# EAGLE design TriVCO_board_layout_FINAL_edited_10-22 (EAGLE 9.6.2)
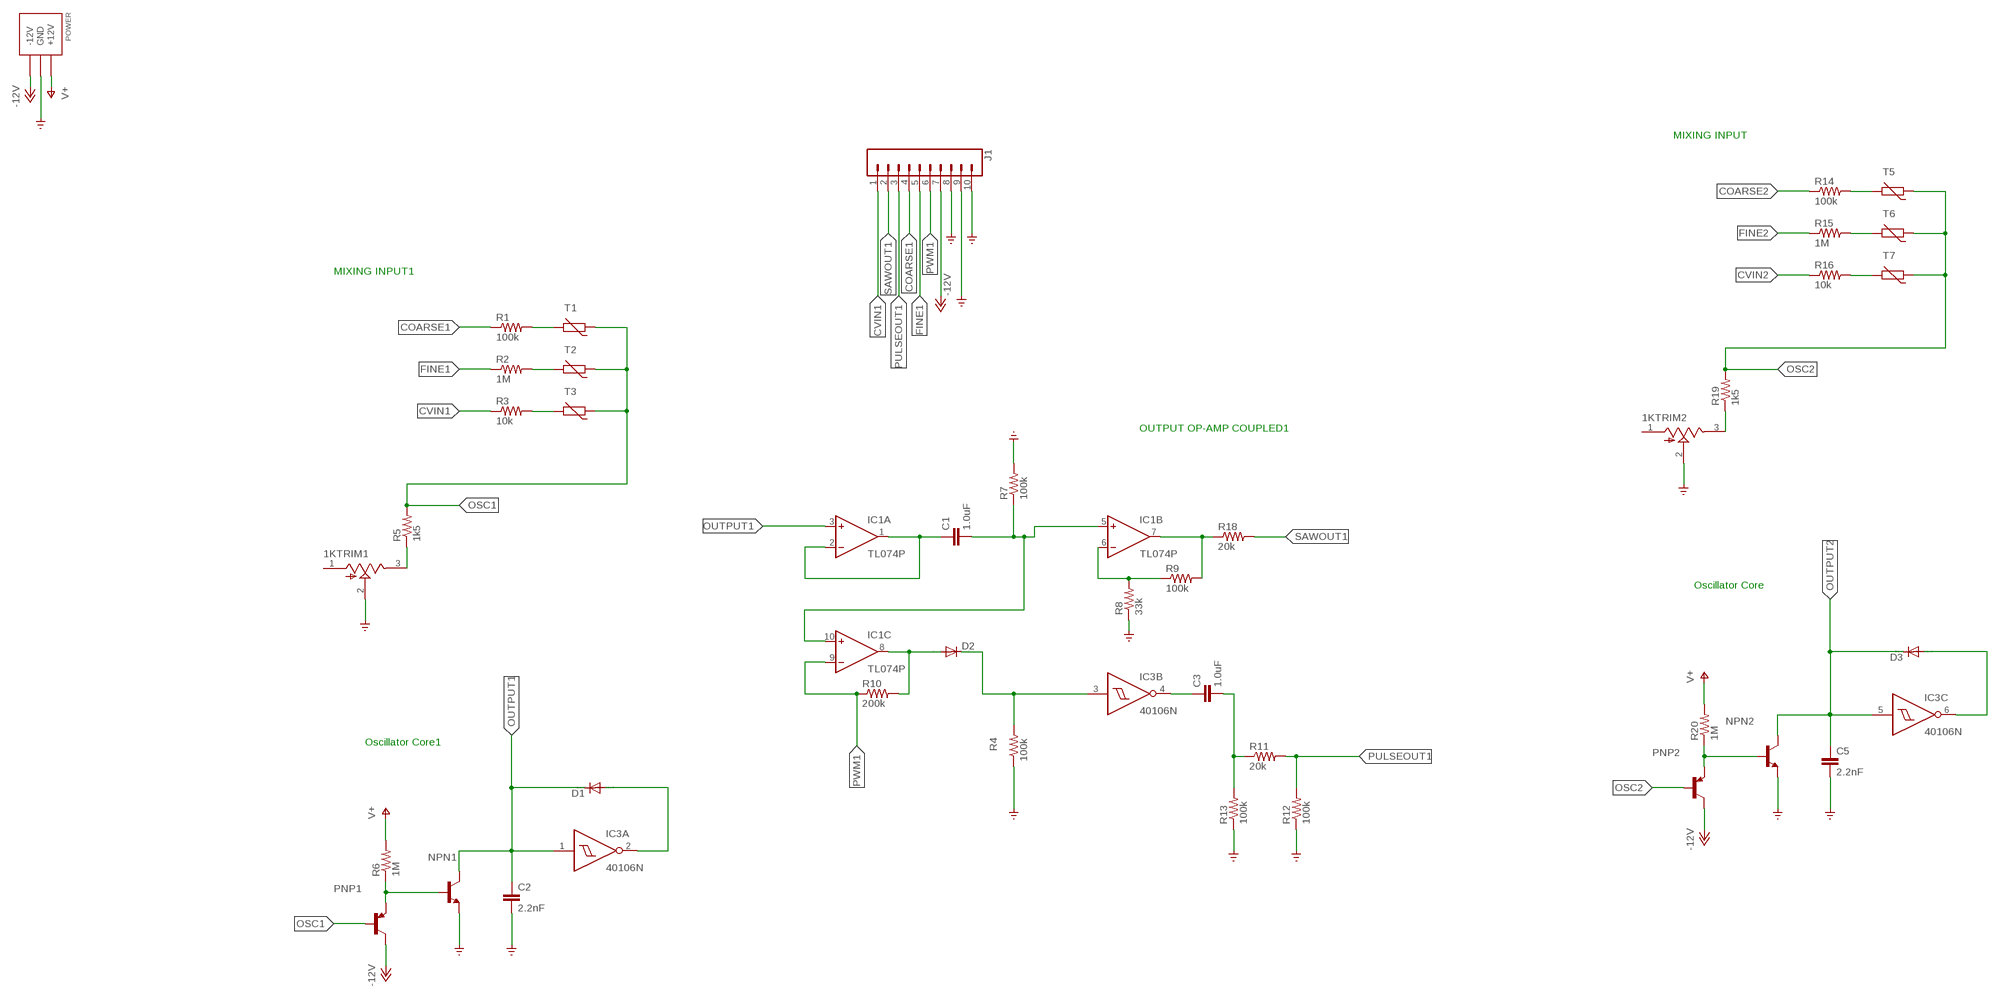
[diagram p0: schematic, sheet 1, part 1 of 2]
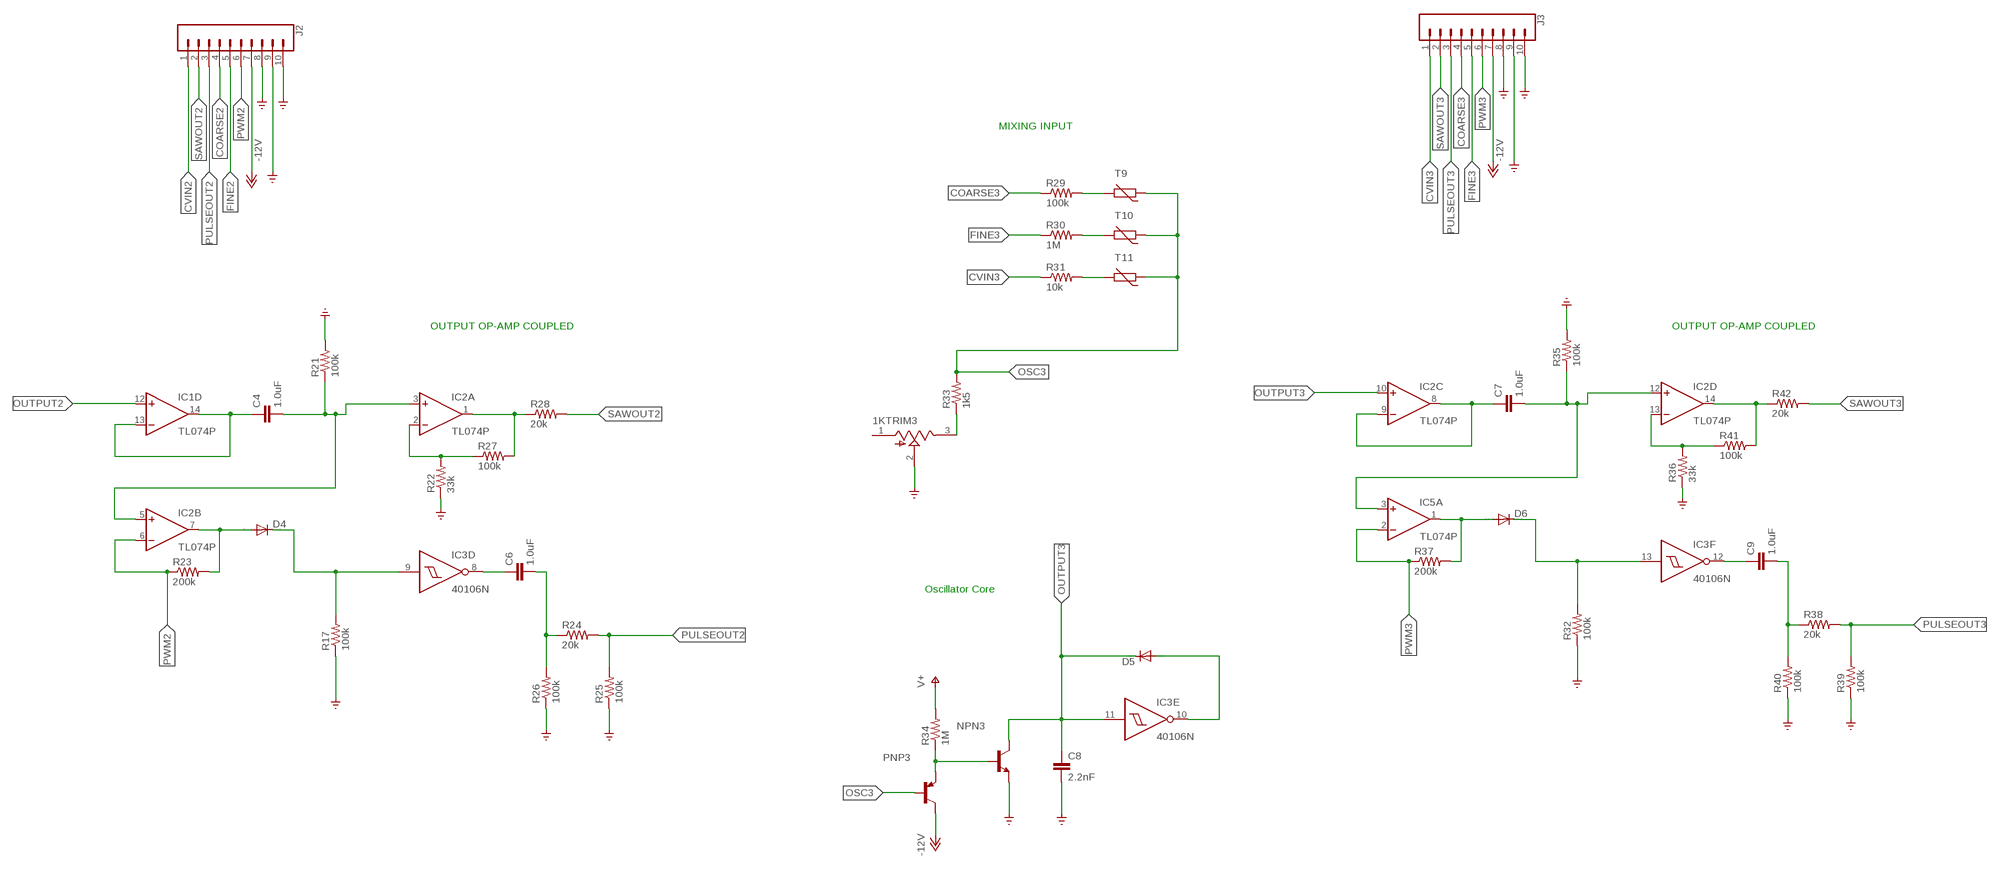
[diagram p1: schematic, sheet 1, part 2 of 2]

## Parts
1KTRIM1  3362P-1-102LF  [TRIM_3362P-1-102LF]
1KTRIM2  3362P-1-102LF  [TRIM_3362P-1-102LF]
1KTRIM3  3362P-1-102LF  [TRIM_3362P-1-102LF]
C1  1.0uF  1.0UF-0603-16V-10%  [0603]
C2  2.2nF  1.0UF-0603-16V-10%  [0603]
C3  1.0uF  1.0UF-0402-16V-10%  [0402]
C4  1.0uF  1.0UF-0603-16V-10%  [0603]
C5  2.2nF  1.0UF-0603-16V-10%  [0603]
C6  1.0uF  1.0UF-0402-16V-10%  [0402]
C7  1.0uF  1.0UF-0603-16V-10%  [0603]
C8  2.2nF  1.0UF-0603-16V-10%  [0603]
C9  1.0uF  1.0UF-0402-16V-10%  [0402]
D1  1N4148DO35-7  [DO35-7]
D2  1N4148DO35-7  [DO35-7]
D3  1N4148DO35-7  [DO35-7]
D4  1N4148DO35-7  [DO35-7]
D5  1N4148DO35-7  [DO35-7]
D6  1N4148DO35-7  [DO35-7]
IC1  TL074P  [DIL14]
IC2  TL074P  [DIL14]
IC3  40106N  [DIL14]
IC5  TL074P  [DIL14]
J1  CONN_10"  [1X10]
J2  CONN_10"  [1X10]
J3  CONN_10"  [1X10]
NPN1  BC485-NPN-TO92-CBE  [TO92-CBE]
NPN2  BC485-NPN-TO92-CBE  [TO92-CBE]
NPN3  BC485-NPN-TO92-CBE  [TO92-CBE]
PNP1  BC450-PNP-TO92-EBC  [TO92-EBC]
PNP2  BC450-PNP-TO92-EBC  [TO92-EBC]
PNP3  BC450-PNP-TO92-EBC  [TO92-EBC]
POWER  POWER_SIMPLE10  [POWER_10]
R1  100k  R-US_0207/10  [0207/10]
R2  1M  R-US_0207/10  [0207/10]
R3  10k  R-US_0207/10  [0207/10]
R4  100k  R-US_0207/10  [0207/10]
R5  1k5  R-US_0207/10  [0207/10]
R6  1M  R-US_0207/10  [0207/10]
R7  100k  R-US_0207/10  [0207/10]
R8  33k  R-US_0207/10  [0207/10]
R9  100k  R-US_0207/10  [0207/10]
R10  200k  R-US_0207/10  [0207/10]
R11  20k  R-US_0207/10  [0207/10]
R12  100k  R-US_0207/10  [0207/10]
R13  100k  R-US_0207/10  [0207/10]
R14  100k  R-US_0207/10  [0207/10]
R15  1M  R-US_0207/10  [0207/10]
R16  10k  R-US_0207/10  [0207/10]
R17  100k  R-US_0207/10  [0207/10]
R18  20k  R-US_0207/10  [0207/10]
R19  1k5  R-US_0207/10  [0207/10]
R20  1M  R-US_0207/10  [0207/10]
R21  100k  R-US_0207/10  [0207/10]
R22  33k  R-US_0207/10  [0207/10]
R23  200k  R-US_0207/10  [0207/10]
R24  20k  R-US_0207/10  [0207/10]
R25  100k  R-US_0207/10  [0207/10]
R26  100k  R-US_0207/10  [0207/10]
R27  100k  R-US_0207/10  [0207/10]
R28  20k  R-US_0207/10  [0207/10]
R29  100k  R-US_0207/10  [0207/10]
R30  1M  R-US_0207/10  [0207/10]
R31  10k  R-US_0207/10  [0207/10]
R32  100k  R-US_0207/10  [0207/10]
R33  1k5  R-US_0207/10  [0207/10]
R34  1M  R-US_0207/10  [0207/10]
R35  100k  R-US_0207/10  [0207/10]
R36  33k  R-US_0207/10  [0207/10]
R37  200k  R-US_0207/10  [0207/10]
R38  20k  R-US_0207/10  [0207/10]
R39  100k  R-US_0207/10  [0207/10]
R40  100k  R-US_0207/10  [0207/10]
R41  100k  R-US_0207/10  [0207/10]
R42  20k  R-US_0207/10  [0207/10]
T1  THERMISTOR-5  [R-5]
T2  THERMISTOR-5  [R-5]
T3  THERMISTOR-5  [R-5]
T5  THERMISTOR-5  [R-5]
T6  THERMISTOR-5  [R-5]
T7  THERMISTOR-5  [R-5]
T9  THERMISTOR-5  [R-5]
T10  THERMISTOR-5  [R-5]
T11  THERMISTOR-5  [R-5]

## Nets
COARSE1: J1.4 R1.1
COARSE2: J2.4 R14.1
COARSE3: J3.4 R29.1
CVIN1: J1.1 R3.1
CVIN2: J2.1 R16.1
CVIN3: J3.1 R31.1
FINE1: J1.5 R2.1
FINE2: J2.5 R15.1
FINE3: J3.5 R30.1
GND: 1KTRIM1.2(WIPER) 1KTRIM2.2(WIPER) 1KTRIM3.2(WIPER) C2.2 C5.2 C8.2 J1.8 J1.9 J1.10 J2.8 J2.9 J2.10 J3.8 J3.9 J3.10 NPN1.E NPN2.E NPN3.E POWER.3(GND) POWER.4(GND) POWER.5(GND) POWER.6(GND) POWER.7(GND) POWER.8(GND) R4.1 R7.2 R8.1 R12.1 R13.1 R17.1 R21.2 R22.1 R25.1 R26.1 R32.1 R35.2 R36.1 R39.1 R40.1 ; supply symbol labelled SUPPLY0_GND_
N$1: R14.2 T5.2
N$2: R1.2 T1.2
N$3: R15.2 T6.2
N$4: R2.2 T2.2
N$6: R16.2 T7.2
N$8: 1KTRIM2.3(CW) R19.1
N$9: R3.2 T3.2
N$10: 1KTRIM1.3(CW) R5.1
N$11: NPN1.B PNP1.E R6.1
N$12: NPN2.B PNP2.E R20.1
N$13: D1.A IC3.2(A:O)
N$14: D3.A IC3.6(C:O)
N$15: C1.1 IC1.1(A:OUT) IC1.2(A:-IN)
N$16: C1.2 IC1.5(B:+IN) IC1.10(C:+IN) R7.1
N$17: IC1.6(B:-IN) R8.2 R9.1
N$18: IC1.7(B:OUT) R9.2 R18.1
N$19: C4.1 IC1.13(D:-IN) IC1.14(D:OUT)
N$20: D2.A IC1.8(C:OUT) R10.2
N$21: C4.2 IC2.3(A:+IN) IC2.5(B:+IN) R21.1
N$22: D2.C IC3.3(B:I) R4.2
N$23: C3.1 IC3.4(B:O)
N$24: C3.2 R11.1 R13.2
N$25: IC2.2(A:-IN) R22.2 R27.1
N$26: IC2.1(A:OUT) R27.2 R28.1
N$27: D4.A IC2.7(B:OUT) R23.2
N$28: D4.C IC3.9(D:I) R17.2
N$29: C6.1 IC3.8(D:O)
N$30: C6.2 R24.1 R26.2
N$31: R29.2 T9.2
N$32: R30.2 T10.2
N$34: R31.2 T11.2
N$35: 1KTRIM3.3(CW) R33.1
N$36: NPN3.B PNP3.E R34.1
N$37: D5.A IC3.10(E:O)
N$38: C7.1 IC2.8(C:OUT) IC2.9(C:-IN)
N$39: C7.2 IC2.12(D:+IN) IC5.3(A:+IN) R35.1
N$40: IC2.13(D:-IN) R36.2 R41.1
N$41: IC2.14(D:OUT) R41.2 R42.1
N$42: D6.A IC5.1(A:OUT) R37.2
N$43: D6.C IC3.13(F:I) R32.2
N$44: C9.1 IC3.12(F:O)
N$45: C9.2 R38.1 R40.2
OSC1: PNP1.B R5.2 T1.1 T2.1 T3.1
OSC2: PNP2.B R19.2 T5.1 T6.1 T7.1
OSC3: PNP3.B R33.2 T9.1 T10.1 T11.1
OUTPUT1: C2.1 D1.C IC1.3(A:+IN) IC3.1(A:I) NPN1.C
OUTPUT2: C5.1 D3.C IC1.12(D:+IN) IC3.5(C:I) NPN2.C
OUTPUT3: C8.1 D5.C IC2.10(C:+IN) IC3.11(E:I) NPN3.C
PULSEOUT1: J1.3 R11.2 R12.2
PULSEOUT2: J2.3 R24.2 R25.2
PULSEOUT3: J3.3 R38.2 R39.2
PWM1: IC1.9(C:-IN) J1.6 R10.1
PWM2: IC2.6(B:-IN) J2.6 R23.1
PWM3: IC5.2(A:-IN) J3.6 R37.1
SAWOUT1: J1.2 R18.2
SAWOUT2: J2.2 R28.2
SAWOUT3: J3.2 R42.2
V+: POWER.9(+12V) POWER.10(+12V) R6.2 R20.2 R34.2
V-: J1.7 J2.7 J3.7 PNP1.C PNP2.C PNP3.C POWER.1(-12V) POWER.2(-12V) ; supply symbol labelled -12V
Unconnected: 1KTRIM1.1(CCW) 1KTRIM2.1(CCW) 1KTRIM3.1(CCW) IC5.5(B:+IN) IC5.6(B:-IN) IC5.7(B:OUT) IC5.8(C:OUT) IC5.9(C:-IN) IC5.10(C:+IN) IC5.12(D:+IN) IC5.13(D:-IN) IC5.14(D:OUT)

## Notes on the sheet
- MIXING INPUT
- MIXING INPUT
- MIXING INPUT1
- OUTPUT OP-AMP COUPLED | OUTPUT OP-AMP COUPLED
- OUTPUT OP-AMP COUPLED1
- Oscillator Core
- Oscillator Core
- Oscillator Core1

## Power pins joined to a net without a drawn wire
GND: IC3.7(P:VSS)
V+: IC1.4(P:V+) IC2.4(P:V+) IC3.14(P:VDD) IC5.4(P:V+)
V-: IC1.11(P:V-) IC2.11(P:V-) IC5.11(P:V-)

## Library data of the parts
1KTRIM1-1KTRIM3 = 3362P-1-102LF:3362P-1-102LF: Res Cermet Trimmer 50K Ohm 10% 1/2W 1(Elec)/1(Mech)Turn 2.77mm (6.6 X 6.99 X 4.7mm) Pin Thru-Hole Tube Check prices <https://pricing.snapeda.com/parts/3362P-1-102LF/Bourns/view-part?ref=eda>; AVAILABILITY: Good; DESCRIPTION: 1 kOhms 0.5W, 1/2W PC Pins Through Hole Trimmer Potentiometer Cermet 1 Turn Top Adjustment; MF: Bourns; MP: 3362P-1-102LF; PACKAGE: 3362P-1 Bourns Inc.; PRICE: None; PURCHASE-URL: https://pricing.snapeda.com/search/part/3362P-1-102LF/?ref=eda
C1 C4 C7 = SparkFun-Capacitors:1.0UF: 1µF ceramic capacitors A capacitor is a passive two-terminal electrical component used to store electrical energy temporarily in an electric field.; PROD_ID: CAP-00868
C2 C5 C8 = SparkFun-Capacitors:1.0UF: 1µF ceramic capacitors A capacitor is a passive two-terminal electrical component used to store electrical energy temporarily in an electric field.; PROD_ID: CAP-00868; VALUE: 1.0uF
C3 C6 C9 = SparkFun-Capacitors:1.0UF: 1µF ceramic capacitors A capacitor is a passive two-terminal electrical component used to store electrical energy temporarily in an electric field.; PROD_ID: CAP-12417
D1-D6 = diode:1N4148: DIODE high speed (Philips)
IC1 IC2 IC5 = linear2:TL074: OP AMP
IC3 = 40xx:40106: Hex SCHMITT TRIGGER
J1-J3 = SparkFun-Connectors:CONN_10: Multi connection point. Often used as Generic Header-pin footprint for 0.1 inch spaced/style header connections On any of the 0.1 inch spaced packages, you can populate with these: Break Away Headers - Straight <https://www.sparkfun.com/products/116> (PRT-00116) Break Away Male Headers - Right Angle <https://www.sparkfun.com/products/553> (PRT-00553) Female Headers <https://www.sparkfun.com/products/115> (PRT-00115) Break Away Headers - Machine Pin <https://www.sparkfun.com/products/117> (PRT-00117) Break Away Female Headers - Swiss Machine Pin <https://www.sparkfun.com/products/743> (PRT-00743) Arduino Stackable Header - 10 Pin <https://www.sparkfun.com/products/11376> (PRT-11376) For SCREWTERMINALS and SPRING TERMINALS visit here: Screw Terimnals on SparkFun.com <https://www.sparkfun.com/search/results?term=Screw+Terminals> (5mm/3.5mm/2.54mm spacing) This device is also useful as a general connection point to wire up your design to another part of your project. Our various solder wires solder well into these plated through hole pads. Hook-Up Wire - Assortment (Stranded, 22 AWG) <https://www.sparkfun.com/products/11375> (PRT-11375) Hook-Up Wire - Assortment (Solid Core, 22 AWG) <https://www.sparkfun.com/products/11367> (PRT-11367) View the entire wire category on our website here <https://www.sparkfun.com/categories/141> Special notes: Molex polarized connector foot print use with SKU : PRT-08231 with associated crimp pins and housings. 1MM SMD Version SKU: PRT-10208 NOTES ON THE VARIANTS LOCK and LOCK_LONGPADS... This footprint was designed to help hold the alignment of a through-hole component (i.e. 6-pin header) while soldering it into place. You may notice that each hole has been shifted either up or down by 0.005 of an inch from it's more standard position (which is a perfectly straight line). This slight alteration caused the pins (the squares in the middle) to touch the edges of the holes. Because they are alternating, it causes a "brace" to hold the component in place. 0.005 has proven to be the perfect amount of "off-center" position when using our standard breakaway headers. Although looks a little odd when you look at the bare footprint, once you have a header in there, the alteration is very hard to notice. Also,if you push a header all the way into place, it is covered up entirely on the bottom side.; PROD_ID: CONN-11563
NPN1-NPN3 = transistor:*-NPN-: NPN Transistror BF959 corrected 2008.03.06
PNP1-PNP3 = transistor:*-PNP-: PNP Transistror
POWER = EurorackModularParts:POWER_SIMPLE
R1-R42 = resistor:R-US_: RESISTOR, American symbol
T1-T3 T5-T7 T9-T11 = varistor:THERMISTOR: THERMISTOR

## Board
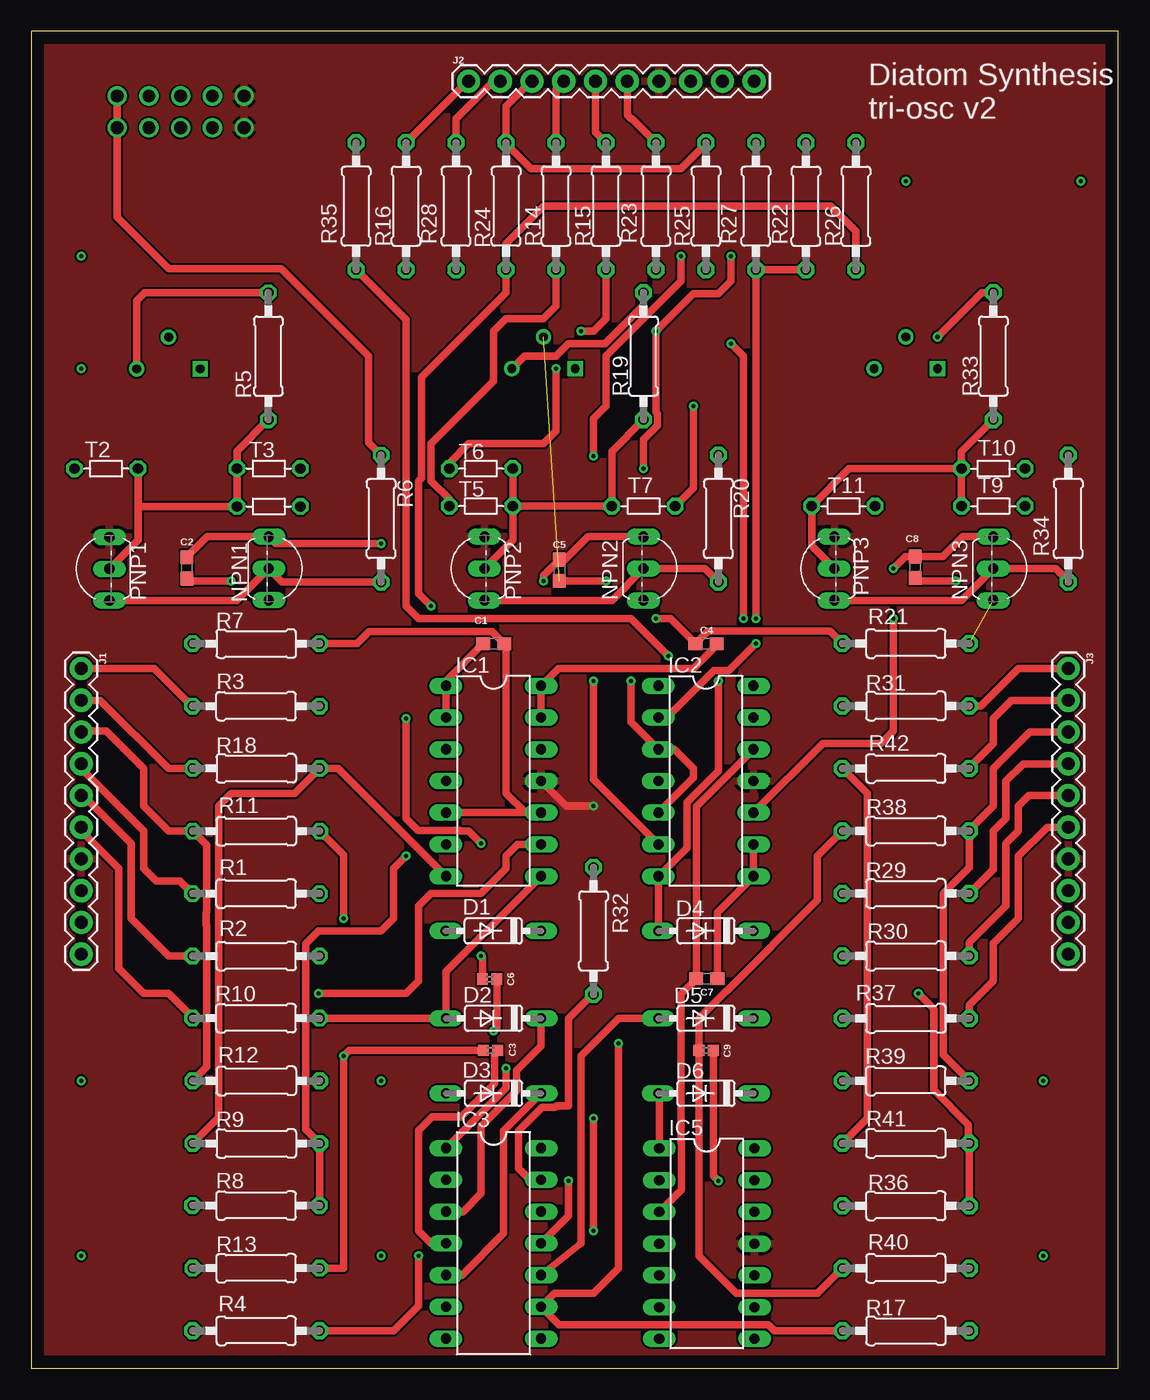
[diagram p2: board, top side]
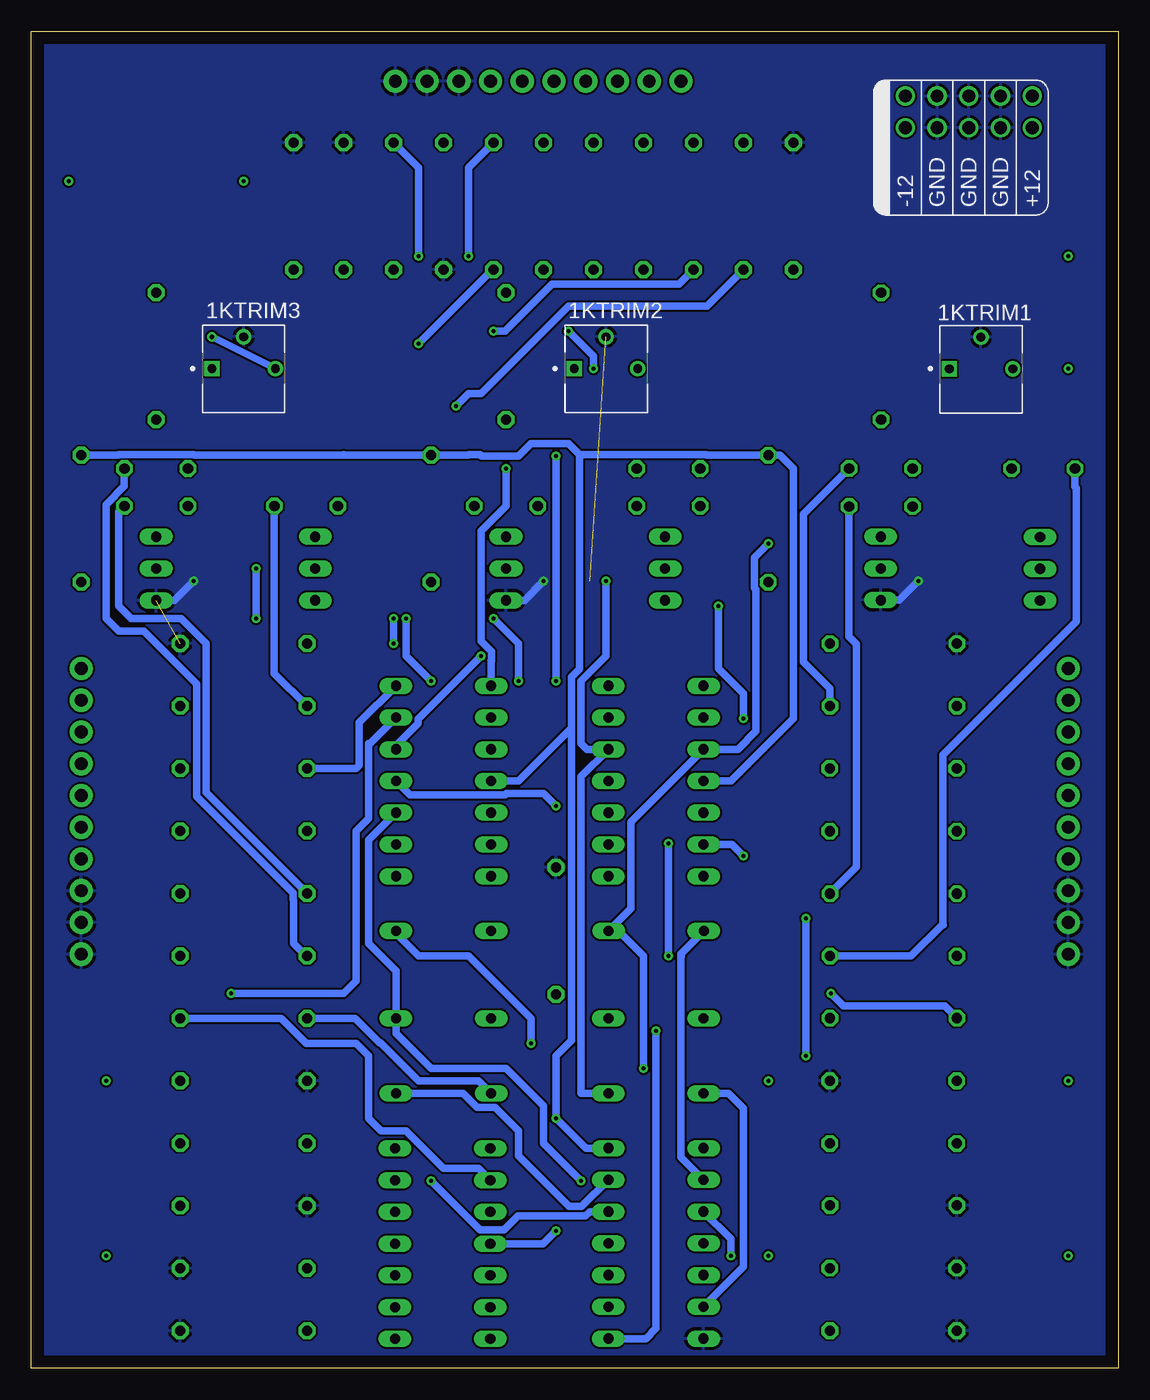
[diagram p3: board, bottom side, seen from below]

Size 87 x 107 mm. Coordinates in mm from the lower left corner, seen from the top.
Outline: 0,0 87,0 87,107 0,107 0,0
Copper layers (1*16): Top 0.035mm / dielectric 1.5mm / Bottom 0.035mm
Design rules "default": minimum track width 6mil, minimum drill 0.35mm, track to track 6mil, track to pad 6mil, pad to pad 6mil, via to via 6mil, smd to smd 6mil, copper to edge 40mil, drill to drill 6mil, minimum pad ring 10mil, minimum via ring 8mil, stop-mask expansion 4mil, vias tented up to drill 0mil, thermal gap 10mil

### Footprints (pad centres in the part's own frame; a part is rotated, then mirrored left to right if it is on the bottom)
TRIM_3362P-1-102LF = drill 0.714 square: 1 -2.54,0 | drill 0.714: 2 0,2.54; 3 2.54,0
0603 = smd 1.1 x 1: 1 -0.85,0; 2 0.85,0
0402 = smd 0.85 x 0.9: 1 -0.58,0; 2 0.58,0
DO35-7 = drill 0.813 long: A 3.81,0; C -3.81,0
DIL14 = drill 0.813 long: 1 -7.62,-3.81; 2 -5.08,-3.81; 3 -2.54,-3.81; 4 0,-3.81; 5 2.54,-3.81; 6 5.08,-3.81; 7 7.62,-3.81; 8 7.62,3.81; 9 5.08,3.81; 10 2.54,3.81; 11 0,3.81; 12 -2.54,3.81; 13 -5.08,3.81; 14 -7.62,3.81
1X10 = drill 1.016 pad 1.88: 1 0,0; 2 2.54,0; 3 5.08,0; 4 7.62,0; 5 10.16,0; 6 12.7,0; 7 15.24,0; 8 17.78,0; 9 20.32,0; 10 22.86,0
TO92-CBE = drill 0.813 long: B 0,0; C -2.54,0; E 2.54,0
TO92-EBC = drill 0.813 long: B 0,-1.27; C 2.54,-1.27; E -2.54,-1.27
POWER_10 = drill 1.016: 1 -5.08,-1.27; 2 -5.08,1.27; 3 -2.54,-1.27; 4 -2.54,1.27; 5 0,-1.27; 6 0,1.27; 7 2.54,-1.27; 8 2.54,1.27; 9 5.08,-1.27; 10 5.08,1.27
0207/10 = drill 0.813 octagon: 1 -5.08,0; 2 5.08,0
R-5 = drill 0.813 octagon: 1 -2.54,0; 2 2.54,0

### Placement (x,y rotation side)
1KTRIM1  10.99,79.98 0 bottom
1KTRIM2  41,80 0 bottom
1KTRIM3  70,80 0 bottom
C1  37.01,57.98 0 top
C2  12.45,64.05 270 top
C3  36.77,25.45 180 top
C4  54,58 180 top
C5  42.27,63.87 270 top
C6  36.69,31.14 180 top
C7  54.08,31.17 180 top
C8  70.74,64.1 270 top
C9  54.02,25.44 180 top
D1  36.98,35 180 top
D2  37,28 180 top
D3  37,22 180 top
D4  54,35 180 top
D5  54,28 180 top
D6  54,22 180 top
IC1  37,47 270 top
IC2  54,47 270 top
IC3  37,10 270 top
IC5  54.07,9.97 270 top
J1  4,56 270 top
J2  35,103 0 top
J3  83,56 270 top
NPN1  19,64 270 top
NPN2  49,64 270 top
NPN3  77,64 270 top
PNP1  4.99,63.98 90 top
PNP2  35,64 90 top
PNP3  63,64 90 top
POWER  11.96,100.55 0 bottom
R1  17.99,37.99 0 top
R2  18,32.99 0 top
R3  17.99,52.99 0 top
R4  18,3 0 top
R5  18.98,81 270 top
R6  28,68 90 top
R7  18,57.99 180 top
R8  18,13.03 0 top
R9  18.01,17.99 180 top
R10  17.99,28.02 0 top
R11  18.01,42.98 180 top
R12  18.01,23 180 top
R13  18,8.01 0 top
R14  42,93 270 top
R15  46,93 270 top
R16  30,93 270 top
R17  70,3 180 top
R18  18.01,48.01 180 top
R19  49,81 270 top
R20  55,68 90 top
R21  70,58 0 top
R22  62,93 270 top
R23  50,93 270 top
R24  38,93 90 top
R25  54,93 90 top
R26  66,93 270 top
R27  58,93 90 top
R28  34,93 90 top
R29  70,38 180 top
R30  70,33 180 top
R31  70,53 180 top
R32  45,35 270 top
R33  77,81 270 top
R34  83,68 90 top
R35  26,93 90 top
R36  70,13 0 top
R37  70,28 180 top
R38  70,43 0 top
R39  70,23 0 top
R40  70,8 180 top
R41  70,18 180 top
R42  70,48 0 top
T1  19,68.97 0 top
T2  6.01,71.99 180 top
T3  19,72.01 0 top
T5  36,69 180 top
T6  36,72 180 top
T7  49,69 0 top
T9  77,69 0 top
T10  77,72 0 top
T11  65,69 0 top

### Tracks (layer width: path | path; a pad name or v marks a point on that pad's centre or on a via)
COARSE1
  Top 0.61: J1.4 4,48 9,43 9,40 10,39 11.9,39 R1.1
COARSE2
  Top 0.61: J2.4 42,102.38 R14.1
COARSE3
  Top 0.61: R29.1 77,39.92 77,43 78,44 78,47 79.38,48.38 J3.4
CVIN1
  Top 0.61: R3.1 12.83,52.99 9.82,56 J1.1
CVIN2
  Top 0.61: J2.1 34.92,103 R16.1
CVIN3
  Top 0.61: R31.1 76,53 79,56 J3.1
FINE1
  Top 0.61: J1.5 4.16,45.84 8,42 8,36 11.01,32.99 R2.1
FINE2
  Top 0.61: R15.1 45.16,98.92 J2.5
FINE3
  Top 0.61: R30.1 75.08,34.08 78,37 78,42 79,43 79,45 79.84,45.84 J3.5
GND  (via drill 0.35)  (2 unrouted)
  Top 0.61: v16,63 12.66,63 C2.2 | C5.2 42.28,63 v46,63 | v74,63 70.99,63 C8.2
  Bottom 0.61: NPN1.E 17.54,61.46 v16,63 | NPN2.E 47.54,61.46 v46,63 | NPN3.E 75.54,61.46 v74,63
  pour Bottom: 0,107 0,0 87,0 87,107
N$1
  Top 0.61: T5.2 33.46,69.54 32,71 32,74 37,79 37,83 38,84 41,84 42,85 R14.2
N$2
  Bottom 0.61: T1.2 21.54,58.54 20.95,57.95 20.95,40.11 R1.2
N$3  (via drill 0.35)
  Top 0.61: v44,83 45,83 46,84 R15.2 | T6.2 33.46,72.46 35,74 41,74 42,75 v42,80
  Bottom 0.61: v44,83 42,81 v42,80
N$4
  Bottom 0.61: T2.2 3.47,70.56 3.36,70.46 3.36,59.75 14.05,49.06 14.05,35.54 | 14,35.49 14.05,35.54 | 14.05,35.54 16.59,32.99 R2.2
N$5  (via drill 0.35)
  other vias: 28,23
N$6  (via drill 0.35)
  Top 0.61: T7.2 53,70.46 v53,77
  Bottom 0.61: v53,77 52,78 51,78 44,85 32.92,85 R16.2
N$7  (via drill 0.35)
  other vias: 28,9
N$8
  Top 0.61: R19.1 49,85.08 45.92,82 43,82 42,81 39.46,81 1KTRIM2.3
N$9
  Bottom 0.61: R3.2 23.07,54.4 25.19,56.53 25.19,68.36 T3.2
N$10
  Top 0.61: 1KTRIM1.3 8.45,85.45 9.08,86.08 R5.1
N$11
  Top 0.61: PNP1.E 16.44,61.44 NPN1.B 20.09,62.92 R6.1
N$12
  Top 0.61: R20.1 53.92,64 NPN2.B 46.46,61.46 PNP2.E
N$13
  Bottom 0.61: 34.97,32.97 35,33 | 35,33 35,33.17 D1.A | IC3.2 35,16.89 35,33
N$14
  Bottom 0.61: D3.A 31.19,22 30,20.81 30,8.11 IC3.6
N$15
  Top 0.61: C1.1 33.19,55.01 IC1.1 IC1.2
N$16
  Top 0.61: IC1.5 IC1.10 39.54,44.46 38,46 38,57.84 C1.2 36.9,58.94 27.03,58.94 26.07,57.99 R7.1
N$17  (via drill 0.35)
  Top 0.61: R8.2 23.08,17.98 R9.1 21.95,19.13 21.95,33.95 23,35 28,35 29,36 29,40 v30,41
  Bottom 0.61: IC1.6 30.92,41.92 v30,41
N$18
  Top 0.61: R9.2 15,20.06 15,45 16.01,46.01 21.09,46.01 R18.1 24.56,48.01 IC1.7
N$19
  Top 0.61: C4.1 54.85,57.85 53,56 42.19,56 IC1.14 IC1.13
N$20
  Top 0.61: R10.2 23.09,28 D2.A 33.19,31.76 IC1.8
N$21  (via drill 0.35)
  Top 0.61: R21.1 63.92,59 54.15,59 C4.2 51.15,60 v50,60 | v48,55 48,51.73 IC2.3 51.46,49.54 53,48 53,47.27 IC2.5
  Bottom 0.61: v48,55 48,58 v50,60
N$22  (via drill 0.35)
  Top 0.61: D2.C 40.81,25.81 38.84,23.84 38.84,22.19 36,19.35 36,14 34.54,12.54 IC3.3 | R4.2 29,3 31,5 v31,9
  Bottom 0.61: v31,9 31,10.35 IC3.3
N$23
  Top 0.61: C3.1 37.08,25.17 37.08,22.81 34.39,20.12 32.07,20.12 31,19.05 31,11 32,10 IC3.4
N$24  (via drill 0.35)
  Top 0.61: R13.2 25,8.01 v25,25 25.45,25.45 C3.2 | R11.1 25,41.07 v25,36
  Bottom 0.61: v25,36 v25,25
N$25  (via drill 0.35)
  Top 0.61: R22.2 R27.1 v58,60 | v58,58 55.84,55.84 54.65,55.84 50.9,52.08 IC2.2
  Bottom 0.61: v58,60 v58,58
N$26  (via drill 0.35)
  Top 0.61: v49,72 49,74.34 50.12,75.46 50.12,76.38 50,76.5 v50,83 53,86 55,86 56,87 v56,89
  Bottom 0.61: IC2.1 50.19,56.63 50.16,56.65 50.16,57.35 51,58.18 51,67 49,69 v49,72 | v50,83 49.08,83 45.32,86.76 35.16,86.76 R28.1 | R27.2 56,96.08 v56,89
N$27  (via drill 0.35)
  Top 0.61: v55,55 55,47.81 52.47,45.27 52.47,41.66 IC2.7 D4.A | v56,82 57,81 v57,60
  Bottom 0.61: v57,60 57,57 v55,55 | v56,82 50.08,87.92 R23.2
N$28  (via drill 0.35)
  Top 0.61: v47,26 47,8 45,6 41.89,6 IC3.9 42.26,3.47 59.01,3.47 59.48,3 R17.2
  Bottom 0.61: v47,26 47,28 52,33 56,33 57.81,34.81 D4.C
N$29  (via drill 0.35)
  Top 0.61: C6.1 37.27,27.27 v37,27
  Bottom 0.61: IC3.8 37.81,2.38 37,3.19 v37,27
N$30  (via drill 0.35)
  Top 0.61: v32,61 31,62 31,71 31.24,71.24 31.24,79.32 38,86.08 R24.1 38,90 41,93 64,93 66,91 R26.2 | v30,52 30,44 30.96,43.04 34.31,43.04 34.35,43 35,43 v36,42 | v36,33 36.11,32.89 C6.2
  Bottom 0.61: v32,61 32,56 30,54 v30,52 | v36,42 v36,33
N$31
  Bottom 0.61: R29.2 73,46.08 73,58 75,60 79,60 80,61 80,68.54 T9.2
N$32
  Bottom 0.61: T10.2 79.54,70.58 81,69.12 81,60 80,59 78,59 73.76,54.76 73.76,45.76 66.04,38.04 66.04,37.54 66,37.5 66,34 65,33 R30.2
N$33  (via drill 0.35)
  other vias: 81,9
N$34
  Bottom 0.61: T11.2 67.54,55.62 R31.2
N$35  (via drill 0.35)
  Top 0.61: R33.1 76.08,86.08 v72.54,82.54
  Bottom 0.61: 1KTRIM3.3 v72.54,82.54
N$36
  Top 0.61: PNP3.E 74.46,61.46 NPN3.B 82,64 83,63 R34.1
N$37
  Top 0.61: IC3.10 44,10 44,25 47,28 D5.A
N$38
  Top 0.61: C7.1 54.93,36.5 IC2.8 IC2.9
N$39  (via drill 0.35)
  Top 0.61: IC2.12 53.23,44.96 C7.2 52,29.95 52,18.1 52.04,18.06 52.04,14.29 IC5.3 | R35.1 30,83.92 30,61 31,60 48,60 v51,57
  Bottom 0.61: v51,57 56.03,51.97 56.03,51.62 57.81,49.84 IC2.12
N$40  (via drill 0.35)
  Top 0.61: R36.2 R41.1 75,18.08 75,19.5 72.24,22.26 72.24,28.76 v71,30
  Bottom 0.61: IC2.13 59.89,50 60,50 60,44 61,43 61,31 62,30 v71,30
N$41
  Top 0.61: R42.1 66.92,46 66.92,20 R41.2
  Bottom 0.61: R42.1 61,48 60.76,48.24 60.76,51.67 IC2.14
N$42
  Top 0.61: D6.A 50.26,21.93 IC5.1
  Bottom 0.61: D6.A 51.19,23 56,23 59,26 59.05,26.05 59.13,26.05 61.08,28 R37.2
N$43
  Top 0.61: IC3.13 39.92,15.08 39,16 39,19 40.88,20.88 41.93,20.88 42.05,21 43,21 43,28 44.92,29.92 R32.2
  Bottom 0.61: IC3.13 42.95,12.95 43.95,12.95 48,17 48,19 49.88,20.88 51.31,20.88 52.43,22 D6.C
N$44  (via drill 0.35)
  Top 0.61: v55,15 54.6,15.4 C9.1
  Bottom 0.61: IC3.12 42.27,12.54 42.63,12.18 48.05,12.18 49.14,11.09 51.09,11.09 v55,15
N$45
  Top 0.61: R38.1 62.92,41 62.92,37.47 55.67,30.22 55.65,30.22 53.72,28.28 53.44,28 C9.2 53.44,9 56.42,6.01 62.93,6.01 R40.2
N$46  (via drill 0.35)
  other vias: 70,95
N$47  (via drill 0.35)
  other vias: 84,95
N$49  (via drill 0.35)
  other vias: 4,23
N$50  (via drill 0.35)
  other vias: 4,89
N$52  (via drill 0.35)
  other vias: 4,9
N$55  (via drill 0.35)
  other vias: 81,23
N$68  (via drill 0.35)
  other vias: 4,80
OSC1
  Top 0.61: R5.2 16.46,73.41 T3.1 T1.1 8.58,68.97 8.56,69 | PNP1.B 8.56,66.28 8.56,69 | T2.1 8.55,69.01 8.56,69
OSC2
  Top 0.61: R19.2 46.46,73.38 T7.1 T5.1 | T5.1 T6.1 | T5.1 38.54,66.27 PNP2.B
OSC3
  Top 0.61: PNP3.B 62.46,65.81 T11.1 65.46,72 T10.1 | T10.1 T9.1 | T10.1 74.46,73.38 R33.2
OUTPUT1  (via drill 0.35)
  Top 0.61: C2.1 14.1,66.54 NPN1.C 19.55,66 v28,66 | IC3.1 38,22.43 v38,24
  Bottom 0.61: 40.4,35.4 39,36.79 39,43.73 IC1.3 30.46,49.54 29,51 29,62.34 29.12,62.45 29.12,64.88 v28,66 | 40.4,35.4 D1.C | v38,24 38,33 40.4,35.4
OUTPUT2  (via drill 0.35)
  Top 0.61: NPN2.C 44.54,66.54 42.72,64.72 C5.1 41,63.45 v41,63 | D3.C 37.81,19 37.81,10.81 34.46,7.46 IC3.5
  Bottom 0.61: v41,63 41,57 43,55 43,50 42.54,49.54 IC1.12 43,47.35 43,22 D3.C
OUTPUT3  (via drill 0.35)
  Top 0.61: NPN3.C 74.54,66.54 72.95,64.95 C8.1 69.95,64.95 v69,64 | 58.46,44.46 IC2.10 63.35,50 68,50 69,51 v69,60 | v43,15 43,12.19 IC3.11
  Bottom 0.61: v43,15 46,18 46,21 49,24 55,24 57.81,26.81 D5.C 57.81,31.81 60,34 60,42.27 IC2.10 | v69,60 v69,64
PULSEOUT1
  Top 0.61: 14,35.49 14.03,35.52 | R12.2 14.04,24.1 14.04,35.45 14,35.49 | 14,35.49 14,36.49 14.03,36.52 14.03,41.88 R11.2 11.02,42.98 9,45 9,48 6,51 4.08,51 J1.3
PULSEOUT2
  Top 0.61: J2.3 40,103 38,101 R24.2 38,98 40,96 52,96 54,98 R25.2
PULSEOUT3
  Top 0.61: J3.3 79.92,50.92 77,48 77,45 75.08,43.08 R38.2 75.08,40.08 73,38 73,25.08 R39.2
PWM1  (via drill 0.35)
  Top 0.61: R10.1 12.91,28.09 11,30 9,30 7,32 7,40 4,43 J1.6 | IC1.9 38.92,41.92 38,41 38,40 36,38 32,38 31,37 31,31 30,30 v23,30
  Bottom 0.61: R10.1 13.89,29 22,29 v23,30
PWM2  (via drill 0.35)
  Top 0.61: IC2.6 45,47.11 v45,55 | v45,73 45,76 46,77 46,81 52,87 v52,89 | R23.1 48.08,100 48,100 47.7,100.3 J2.6
  Bottom 0.61: v45,73 v45,55 | v52,89 52,96.08 R23.1
PWM3
  Top 0.61: R37.1 75.08,29.08 77,31 77,34 79,36 79,41 81.3,43.3 J3.6
  Bottom 0.61: IC5.2 51.21,16 54,16 57,19 59,19 60,20 60,25 61,26 65,26 67,28 R37.1
SAWOUT1
  Top 0.61: R18.2 10.99,48.01 5.54,53.46 J1.2
SAWOUT2
  Top 0.61: R28.2 34,100 37,103 J2.2
SAWOUT3
  Top 0.61: R42.2 75.08,48.08 77,50 77,52 78.46,53.46 J3.2
V+  (via drill 0.35)
  Top 0.61: POWER.10 POWER.9 6.88,92.12 11,88 20,88 27,81 27,74.08 R6.2 | v45,11 v45,20
  Bottom 0.61: 43.12,73.12 44,74 47,74 48,73 50.96,73 51.08,73.12 52,73.12 52.04,73.08 R20.2 61.96,73.08 | 43.12,73.12 33,73.12 32.96,73.08 R6.2 27.08,73.08 26,72 26,52 31,47 IC1.4 | R34.2 80.04,73.08 80,73.12 74,73.12 73.96,73.08 61.96,73.08 | 43.12,73.12 43.12,55.96 43.76,55.32 43.76,51.24 | 43.76,51.24 48,47 IC2.4 | 61.96,73.08 62,73.12 | IC3.14 42.62,17.62 v45,20 45,25 43.76,26.24 43.76,51.24 | IC5.4 46.03,9.97 v45,11
V-  (via drill 0.35)
  Top 0.61: v45,45 42.81,45 IC1.11
  Bottom 0.61: IC2.11 56.69,45.88 49.07,45.88 48.95,46 46,46 v45,45
  pour Top: -1,108 -1,0 87,0 87,108

### Text on the board
tValues: T4 | T1
tSilk: Diatom Synthesis / tri-osc v2